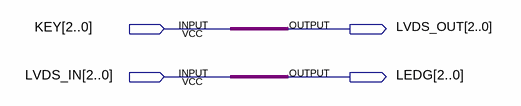
[diagram p0: schematic sheet]
// Quartus schematic de0.bdf as structural Verilog: 0 symbols, 4 pins
module de0 (
  input  [2:0] KEY,
  input  [2:0] LVDS_IN,
  output [2:0] LVDS_OUT,
  output [2:0] LEDG
);


  assign LEDG = LVDS_IN;
  assign LVDS_OUT = KEY;
endmodule
